# EAGLE design DCDCDC-R2 (EAGLE 9.5.1)
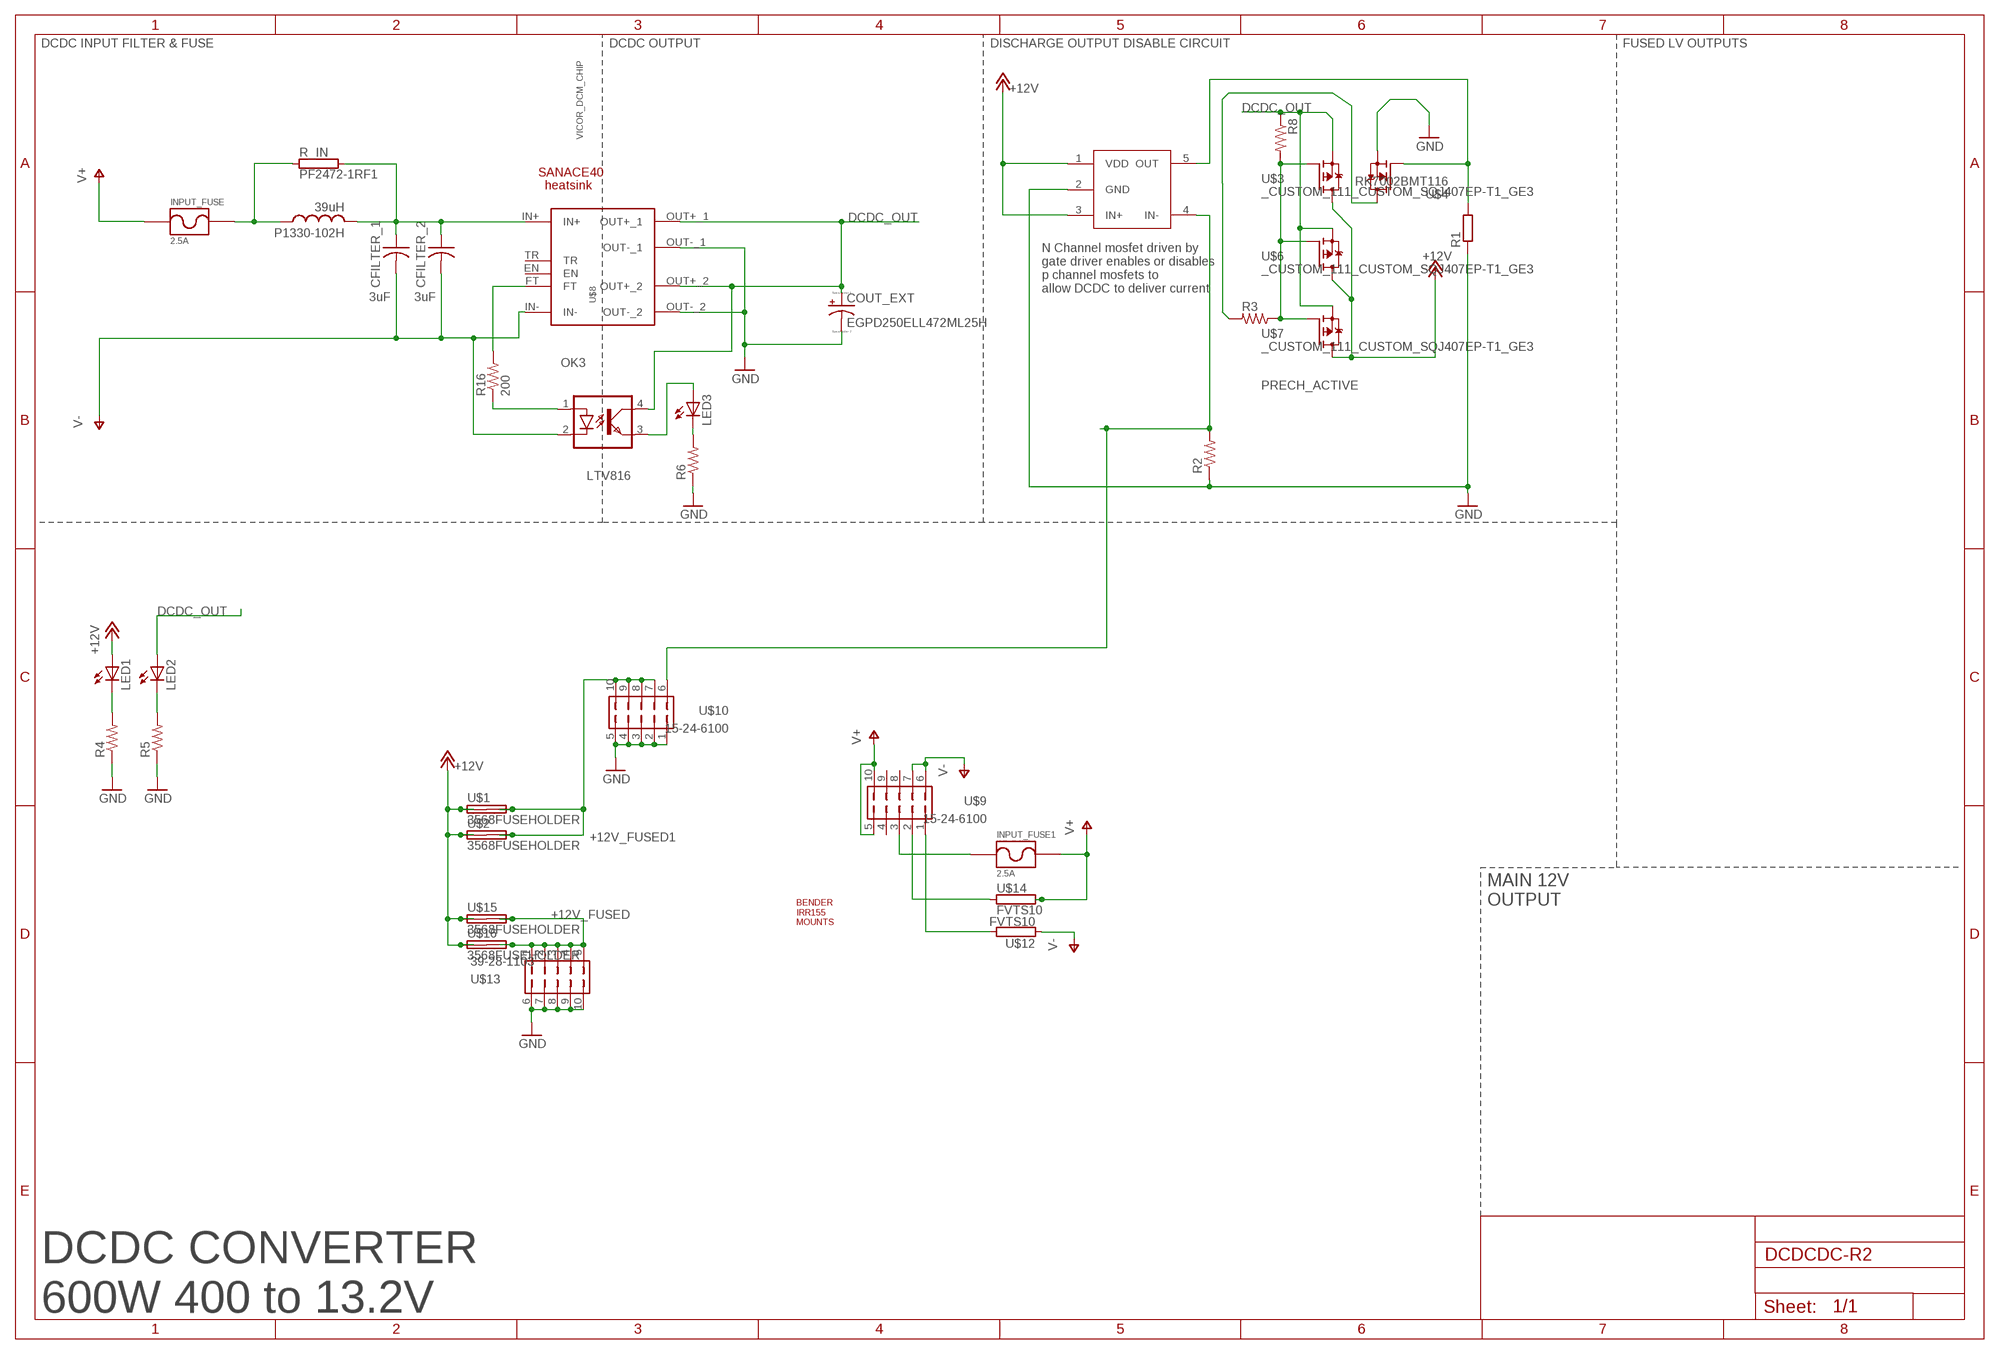
[diagram p0: schematic, sheet 1]

## Parts
CFILTER_1  3uF  B58035U5305M062  [CERALINK_FA3]
CFILTER_2  3uF  B58035U5305M062  [CERALINK_FA3]
COUT_EXT  EGPD250ELL472ML25H  CPOL-USE7.5-16  [E7,5-16]
INPUT_FUSE  2.5A  _CUSTOM_PARTS_LF_885  [_CUSTOM_PARTS_LF_885]
INPUT_FUSE1  2.5A  _CUSTOM_PARTS_LF_885  [_CUSTOM_PARTS_LF_885]
LED1  LED3MM  [LED3MM]
LED2  LED3MM  [LED3MM]
LED3  LED3MM  [LED3MM]
OK3  LTV816  [DIL04]
P1330-102H  39uH  SRP1770TA-390M  [L_1510_NONSTANDARD]
R1  R-EU_R0805  [R0805]
R2  R-US_R0805  [R0805]
R3  R-US_R0805  [R0805]
R4  R-US_R0805  [R0805]
R5  R-US_R0805  [R0805]
R6  R-US_R0805  [R0805]
R8  R-US_R0805  [R0805]
R16  200  R-US_R2010  [R2010]
R_IN  PF2472-1RF1  RMG100-V  [TO-247-2V]
U$1  3568FUSEHOLDER  [3568]
U$2  3568FUSEHOLDER  [3568]
U$3  _CUSTOM_111_CUSTOM_SQJ407EP-T1_GE3  [_CUSTOM_111_CUSTOM_TRANS_SIRA90DP-T1-GE3]
U$4  RK7002BMT116  [SOT23]
U$5  UCC27511AQDBVRQ1  [SOT23-5L]
U$6  _CUSTOM_111_CUSTOM_SQJ407EP-T1_GE3  [_CUSTOM_111_CUSTOM_TRANS_SIRA90DP-T1-GE3]
U$7  _CUSTOM_111_CUSTOM_SQJ407EP-T1_GE3  [_CUSTOM_111_CUSTOM_TRANS_SIRA90DP-T1-GE3]
U$8  VICOR_DCM_CHIP  [VICOR_CHIP_HEATSINK]
U$9  15-24-6100  [15-24-6100]
U$10  15-24-6100  [15-24-6100]
U$11  BENDER_IRR155  [BENDER_IRR155]
U$12  FVTS10  [FVTS10]
U$13  39-28-1103  [39-28-1103]
U$14  FVTS10  [FVTS10]
U$15  3568FUSEHOLDER  [3568]
U$16  3568FUSEHOLDER  [3568]
U$17  VICOR_HEATSINK_19MMLONG  [VICOR_HEATSINK_19MM_LONG]
U$18  SANACE40  [SANACE40]

## Nets
+12V [LV]: LED1.A U$1.L1(1A) U$1.L2(1B) U$2.L1(1A) U$2.L2(1B) U$3.5(D) U$5.1(VDD) U$5.3(IN+) U$6.5(D) U$7.5(D) U$15.L1(1A) U$15.L2(1B) U$16.L1(1A) U$16.L2(1B)
+12V_FUSED: U$13.1 U$13.2 U$13.3 U$13.4 U$13.5 U$15.R1(2A) U$15.R2(2B) U$16.R1(2A) U$16.R2(2B)
+12V_FUSED1: U$1.R1(2A) U$1.R2(2B) U$2.R1(2A) U$2.R2(2B) U$10.7 U$10.8 U$10.9 U$10.10
DCDC_OUT [LV]: COUT_EXT.+ LED2.A OK3.4(COL) R8.1 U$3.1(S) U$3.2(S) U$3.3(S) U$6.1(S) U$6.2(S) U$6.3(S) U$7.1(S) U$7.2(S) U$7.3(S) U$8.OUT+_1 U$8.OUT+_2
GND [LV]: COUT_EXT.- R1.1 R2.1 R4.1 R5.1 R6.1 U$4.2(S) U$5.2(GND) U$8.OUT-_1 U$8.OUT-_2 U$10.1 U$10.2 U$10.3 U$10.4 U$10.5 U$13.6 U$13.7 U$13.8 U$13.9 U$13.10
N$1 [LV]: R3.1 R8.2 U$3.4(G) U$6.4(G) U$7.4(G)
N$2 [LV]: R1.2 U$4.1(G) U$5.5(OUT)
N$3 [LV]: CFILTER_1.P$1 CFILTER_2.P$1 P1330-102H.P$2 R_IN.2 U$8.IN+
N$4 [LV]: R3.2 U$4.3(D)
N$5: LED1.K(C) R4.2
N$6: LED2.K(C) R5.2
N$7: R16.2 U$8.FT
N$8: OK3.1(A) R16.1
N$9: LED3.K(C) R6.2
N$10: LED3.A OK3.3(EMIT)
N$11: INPUT_FUSE1.P$1 U$9.3
N$12: U$9.2 U$14.P$1
N$13: U$9.1 U$12.P$2
PRECH_ACTIVE [LV]: R2.2 U$5.4(IN-) U$10.6
V+ [LV]: INPUT_FUSE1.P$2 INPUT_FUSE.P$1 U$9.5 U$9.10 U$14.P$2
V+_FUSED [LV]: INPUT_FUSE.P$2 P1330-102H.P$1 R_IN.1
V- [LV]: CFILTER_1.P$2 CFILTER_2.P$2 OK3.2(C) U$8.IN- U$9.6 U$9.7 U$12.P$1
Unconnected: U$8.EN U$8.TR U$9.4 U$9.8 U$9.9

## Notes on the sheet
- DCDC INPUT FILTER & FUSE | DCDC OUTPUT | DISCHARGE OUTPUT DISABLE CIRCUIT | FUSED LV OUTPUTS
- N Channel mosfet driven by 
  gate driver enables or disables 
  p channel mosfets to 
  allow DCDC to deliver current
- MAIN 12V
  OUTPUT
- DCDC CONVERTER 
  600W 400 to 13.2V

## Library data of the parts
CFILTER_1 CFILTER_2 = ACC-MB-R0:B58035U5305M062
COUT_EXT = ACC-MB-R0:CPOL-US: POLARIZED CAPACITOR, American symbol
INPUT_FUSE INPUT_FUSE1 = ACC-MB-R0:_CUSTOM_PARTS_LF_885
LED1-LED3 = ACC-MB-R0:LED: LED OSRAM: - CHIPLED LG R971, LG N971, LY N971, LG Q971, LY Q971, LO R971, LY R971 LH N974, LH R974 LS Q976, LO Q976, LY Q976 LO Q996 - Hyper CHIPLED LW Q18S LB Q993, LB Q99A, LB R99A - SideLED LS A670, LO A670, LY A670, LG A670, LP A670 LB A673, LV A673, LT A673, LW A673 LH A674 LY A675 LS A676, LA A676, LO A676, LY A676, LW A676 LS A679, LY A679, LG A679 - Hyper Micro SIDELED® LS Y876, LA Y876, LO Y876, LY Y876 LT Y87S - SmartLED LW L88C, LW L88S LB L89C, LB L89S, LG L890 LS L89K, LO L89K, LY L89K LS L896, LA L896, LO L896, LY L896 - TOPLED LS T670, LO T670, LY T670, LG T670, LP T670 LSG T670, LSP T670, LSY T670, LOP T670, LYG T670 LG T671, LOG T671, LSG T671 LB T673, LV T673, LT T673, LW T673 LH T674 LS T676, LA T676, LO T676, LY T676, LB T676, LH T676, LSB T676, LW T676 LB T67C, LV T67C, LT T67C, LS T67K, LO T67K, LY T67K, LW E67C LS E67B, LA E67B, LO E67B, LY E67B, LB E67C, LV E67C, LT E67C LW T67C LS T679, LY T679, LG T679 LS T770, LO T770, LY T770, LG T770, LP T770 LB T773, LV T773, LT T773, LW T773 LH T774 LS E675, LA E675, LY E675, LS T675 LS T776, LA T776, LO T776, LY T776, LB T776 LHGB T686 LT T68C, LB T68C - Hyper Mini TOPLED® LB M676 - Mini TOPLED Santana® LG M470 LS M47K, LO M47K, LY M47K Source: http://www.osram.convergy.de LUXEON: - LUMILED® LXK2-PW12-R00, LXK2-PW12-S00, LXK2-PW14-U00, LXK2-PW14-V00 LXK2-PM12-R00, LXK2-PM12-S00, LXK2-PM14-U00 LXK2-PE12-Q00, LXK2-PE12-R00, LXK2-PE12-S00, LXK2-PE14-T00, LXK2-PE14-U00 LXK2-PB12-K00, LXK2-PB12-L00, LXK2-PB12-M00, LXK2-PB14-N00, LXK2-PB14-P00, LXK2-PB14-Q00 LXK2-PR12-L00, LXK2-PR12-M00, LXK2-PR14-Q00, LXK2-PR14-R00 LXK2-PD12-Q00, LXK2-PD12-R00, LXK2-PD12-S00 LXK2-PH12-R00, LXK2-PH12-S00 LXK2-PL12-P00, LXK2-PL12-Q00, LXK2-PL12-R00 Source: www.luxeon.com KINGBRIGHT: KA-3528ASYC Source: www.kingbright.com
OK3 = optocoupler:LTV816: OPTO COUPLER Source: LITEON, LTV816.pdf; OC_FARNELL: unknown; OC_NEWARK: unknown
P1330-102H = ACC-MB-R0:SRP1770TA-390M
R1 = ACC-MB-R0:R-EU_: RESISTOR, European symbol; SPICEPREFIX: R
R2-R6 R8 = ACC-MB-R0:R-US_: RESISTOR, American symbol; SPICEPREFIX: R
R16 = Main:R-US_: RESISTOR, American symbol; SPICEPREFIX: R
R_IN = ACC-MB-R0:RMG100: TO-247 Power Resistor - RMG 100 Series Source: www.token.com.tw .. power-resistor-rmg100pdf; OC_FARNELL: unknown; OC_NEWARK: unknown
U$1 U$2 U$15 U$16 = ACC-MB-R0:3568FUSEHOLDER: 3568 20AMP 500VAC
U$3 U$6 U$7 = ACC-MB-R0:_CUSTOM_111_CUSTOM_SQJ407EP-T1_GE3
U$4 = ACC-MB-R0:RK7002BMT116
U$5 = ACC-MB-R0:UCC27511AQDBVRQ1
U$8 = ACC-MB-R0:VICOR_DCM_CHIP
U$9 U$10 = ACC-MB-R0:15-24-6100
U$11 = ACC-MB-R0:BENDER_IRR155
U$12 U$14 = ACC-MB-R0:FVTS10
U$13 = ACC-MB-R0:39-28-1103
U$17 = ACC-MB-R0:VICOR_HEATSINK_19MM
U$18 = ACC-MB-R0:SANACE40

## Net classes
0 default: width 0.1 mm, clearance 0.6 mm
1 LV: clearance 0.1 mm

## Board
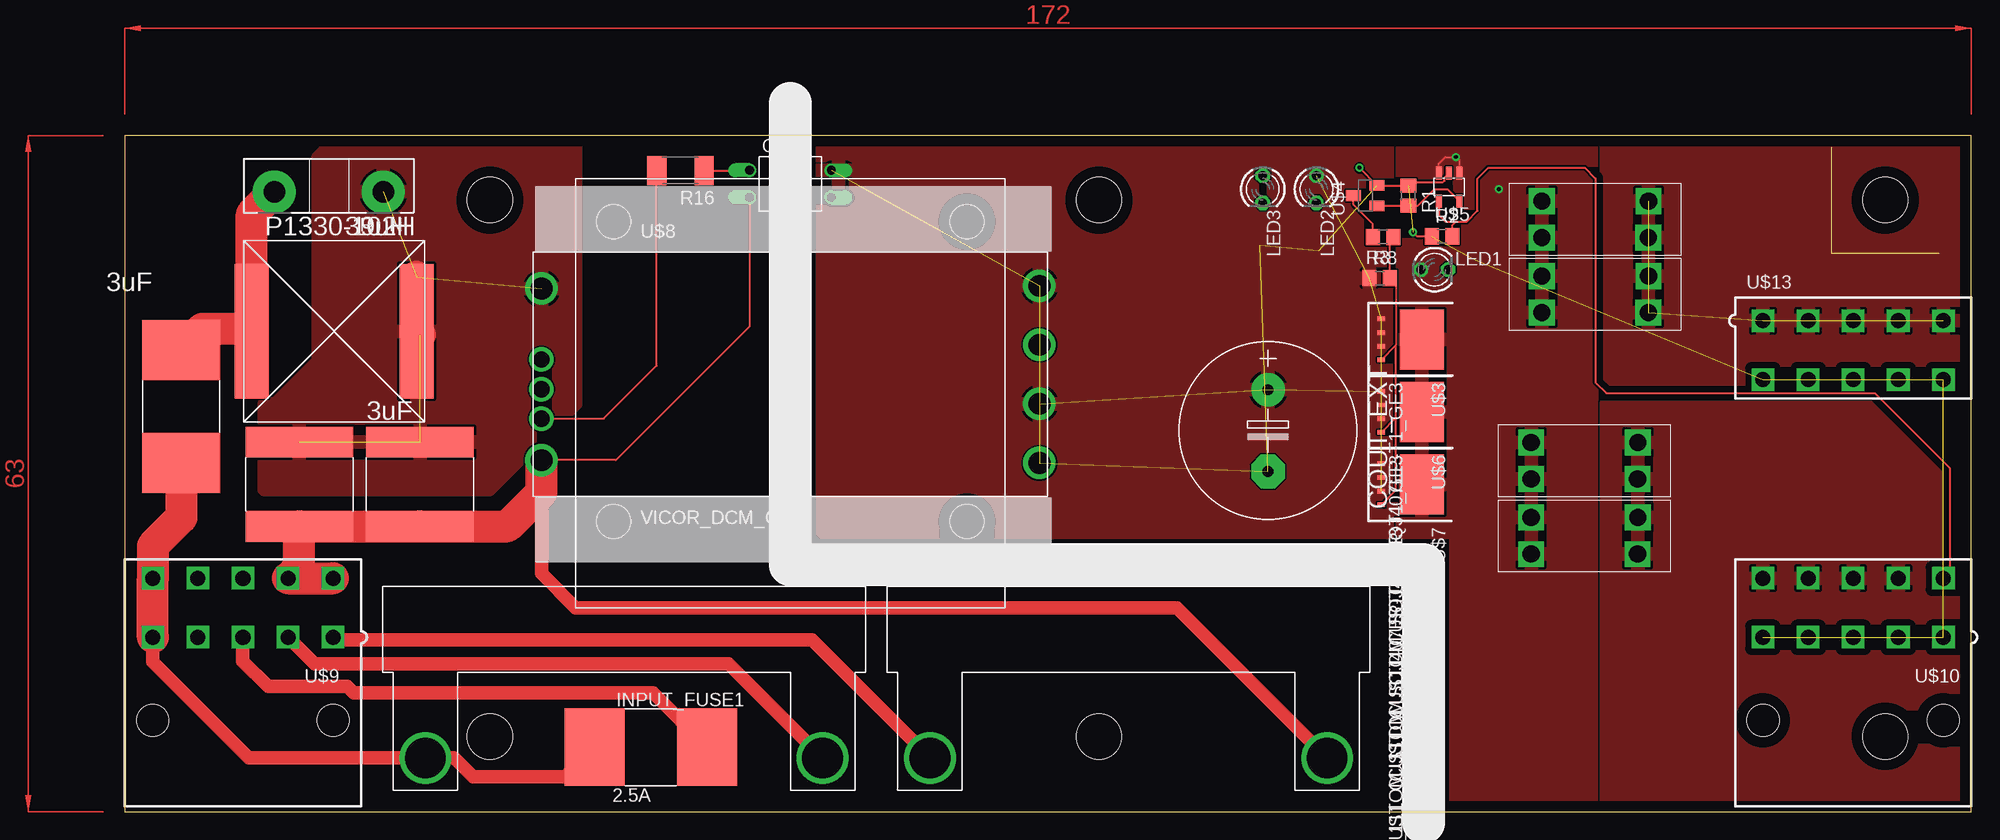
[diagram p1: board, top side]
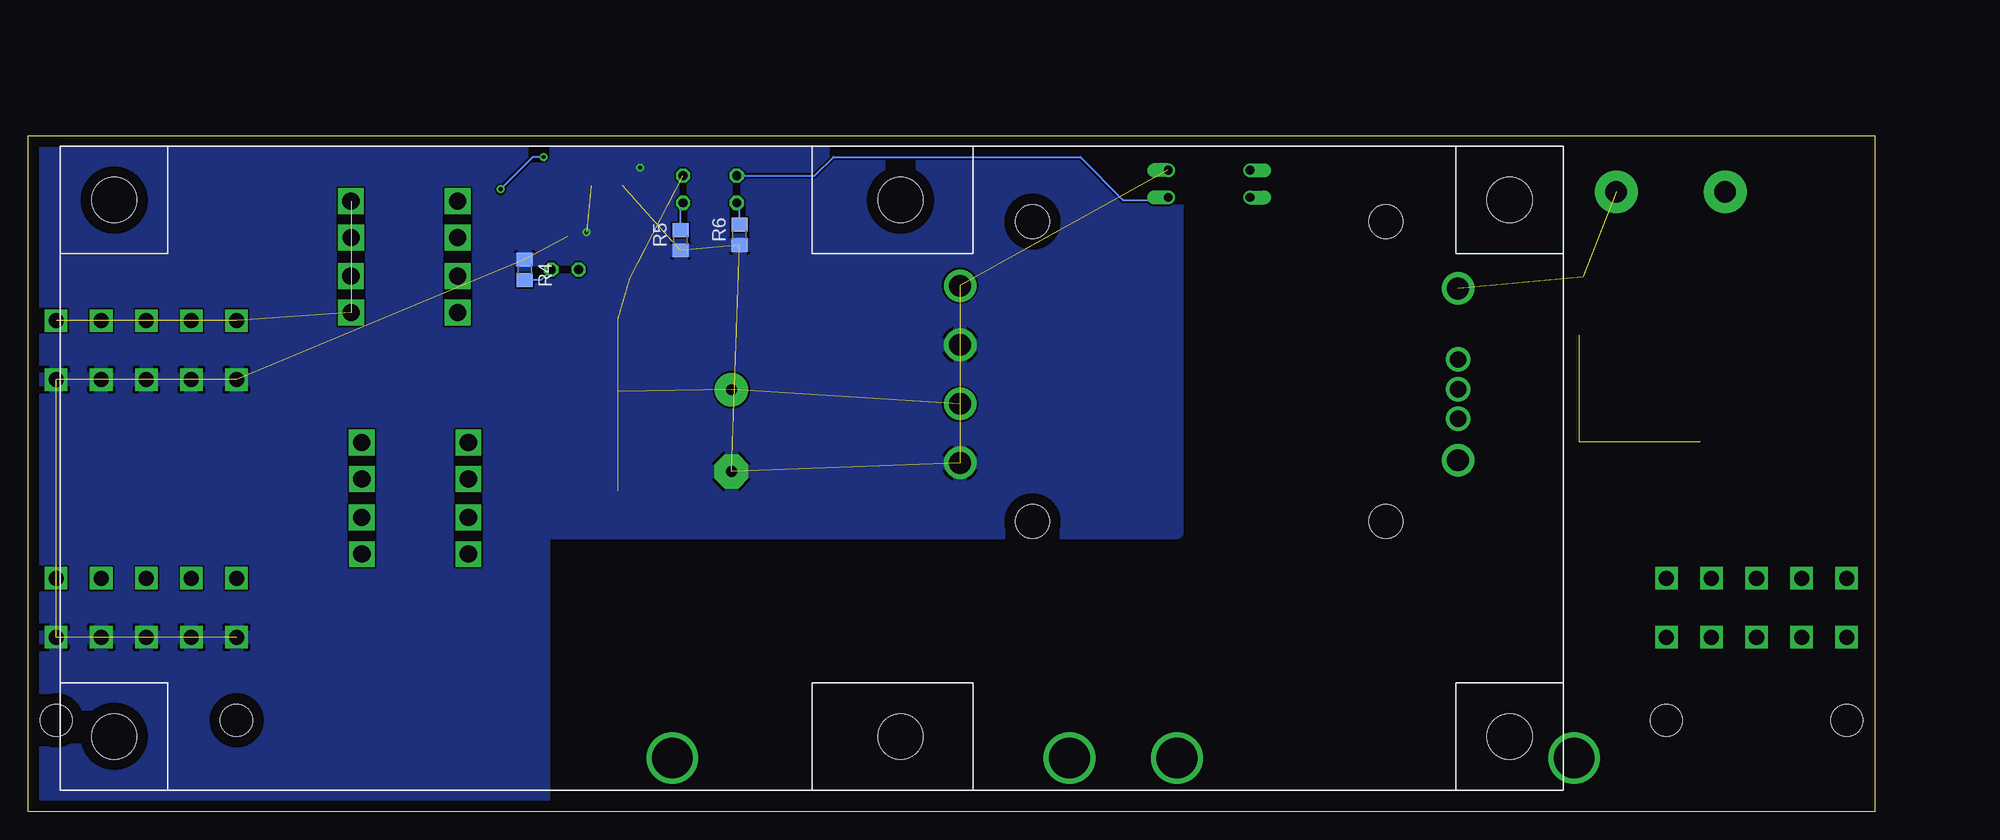
[diagram p2: board, bottom side, seen from below]

Size 172 x 63 mm. Coordinates in mm from the lower left corner, seen from the top.
Outline: 172,63 0,63 0,0 172,0 172,63
Copper layers (1*16): Top 0.035mm / dielectric 1.5mm / Bottom 0.035mm
Design rules "default": minimum track width 6mil, minimum drill 0.35mm, track to track 6mil, track to pad 6mil, pad to pad 6mil, via to via 6mil, smd to smd 6mil, copper to edge 40mil, drill to drill 6mil, minimum pad ring 10mil, minimum via ring 8mil, stop-mask expansion 4mil, vias tented up to drill 0mil, thermal gap 10mil

### Footprints (pad centres in the part's own frame; a part is rotated, then mirrored left to right if it is on the bottom)
CERALINK_FA3 = smd 2.85 x 10: P$1 -3.925,0; P$2 3.925,0
E7,5-16 = drill 1.016 pad 3.15: + -3.81,0 | drill 1.016 pad 3.15 octagon: - 3.81,0
_CUSTOM_PARTS_LF_885 = smd 5.6 x 7.23: P$1 5.25,0; P$2 -5.25,0
LED3MM = drill 0.813 octagon: A -1.27,0; K 1.27,0
DIL04 = drill 0.813 offset: 1 -1.27,-3.81; 2 1.27,-3.81; 3 1.27,3.81; 4 -1.27,3.81
L_1510_NONSTANDARD = smd 3.15 x 12.5: P$1 -7.675,0; P$2 7.675,0
R0805 = smd 1.3 x 1.5: 1 -0.95,0; 2 0.95,0
R2010 = smd 1.8 x 2.7: 1 -2.2,0; 2 2.2,0
TO-247-2V = drill 2 pad 4: 1 -5.08,0; 2 5.08,0
3568 = drill 1.6 square: L1 0,3.4; L2 0,0; R1 9.94,3.4; R2 9.92,0
_CUSTOM_111_CUSTOM_TRANS_SIRA90DP-T1-GE3 = smd 0.41 x 0.72: 1 -1.905,-2.715; 2 -0.635,-2.715; 3 0.635,-2.715; 4 1.905,-2.715 | smd 5.588 x 4.064: 5 0,1.08
SOT23 = smd 1 x 1.4: 1 -0.95,-1.1; 2 0.95,-1.1; 3 0,1.1
SOT23-5L = smd 0.55 x 1.2: 1 -0.95,-1.3; 2 0,-1.3; 3 0.95,-1.3; 4 0.95,1.3; 5 -0.95,1.3
VICOR_CHIP_HEATSINK = drill 1.52 pad 1.77: EN -23.19,-1.38; FT -23.19,-4.13; TR -23.19,1.38 | drill 2.03 pad 2.28: IN+ -23.19,8; IN- -23.19,-8 | drill 2.03 pad 2.41: OUT+_1 23.19,8.25; OUT+_2 23.19,-2.75; OUT-_1 23.19,2.75; OUT-_2 23.19,-8.25
15-24-6100 = drill 1.4 square: 1 8.4,-2.75; 2 4.2,-2.75; 3 0,-2.75; 4 -4.2,-2.75; 5 -8.4,-2.75; 6 8.4,2.75; 7 4.2,2.75; 8 0,2.75; 9 -4.2,2.75; 10 -8.4,2.75 | hole 3: 8.4,-10.5; -8.4,-10.5
BENDER_IRR155 = hole 4.2: 5,5; 5,55; 78.25,55; 78.25,5; 135,55; 135,5
FVTS10 = drill 3.8: P$1 0,0; P$2 37,0
39-28-1103 = drill 1.4 square: 1 -8.4,-2.75; 2 -4.2,-2.75; 3 0,-2.75; 4 4.2,-2.75; 5 8.4,-2.75; 6 -8.4,2.75; 7 -4.2,2.75; 8 0,2.75; 9 4.2,2.75; 10 8.4,2.75
VICOR_HEATSINK_19MM_LONG = hole 3.175: -16.459,13.97; -16.459,-13.97; 16.459,13.97; 16.459,-13.97

### Placement (x,y rotation side)
CFILTER_1  27.5,30.5 270 top
CFILTER_2  16.25,30.5 270 top
COUT_EXT  106.5,35.5 270 top
INPUT_FUSE  5.25,37.75 270 top
INPUT_FUSE1  49,6 0 top
LED1  122,50.5 0 top
LED2  111,58 270 top
LED3  106,58 270 top
OK3  62,58.5 270 top
P1330-102H  19.5,44.75 0 top
R1  119.55,57.4 270 top
R2  122.7,53.6 0 top
R3  117.2,53.55 180 top
R4  125.75,50.5 270 bottom
R5  111.25,53.25 90 bottom
R6  105.75,53.75 90 bottom
R8  116.9,49.7 0 top
R16  51.75,59.75 180 top
R_IN  19,57.75 0 top
U$1  131,24 0 top
U$2  131,31 0 top
U$3  119.75,44 270 top
U$4  115.55,57.4 90 top
U$5  123.35,58.2 180 top
U$6  119.75,37.25 270 top
U$7  119.75,30.5 270 top
U$8  62,40.75 0 top
U$9  11,19 0 top
U$10  161,19 0 top
U$11  169,2 0 bottom
U$12  112,5 180 top
U$13  161,43 180 top
U$14  65,5 180 top
U$15  132,46.5 0 top
U$16  132,53.5 0 top
U$17  62,41 0 top
U$18  42,19 0 top

### Tracks (layer width: path | path; a pad name or v marks a point on that pad's centre or on a via)
+12V  (via drill 0.35)
  Top 0.2: U$5.3 122.4,60.4 123,61 v124,61 124.3,60.7 U$5.1
  Bottom 0.2: v124,61 125,61 v128,58
  pour Top (rank 2): 119,65 119,26 124,26 124,-3 181,-3 181,64 180,65
+12V_FUSED  (8 unrouted)
  pour Top: 138,40 181,40 181,64 180,64 179,65 138,65
+12V_FUSED1
  pour Top: 138,38 138,-3 181,-3 181,38
DCDC_OUT  (14 unrouted)
  pour Top (rank 3): 65,63 65,26 119,26 119,65 67,65
GND  (via drill 0.35)  (17 unrouted)
  Top 0.2: 123.5,59.65 U$5.2 122.93,59.08 122.93,58.8 122.78,58.65 120.15,58.65 119.85,58.35 R1.1 U$4.2 v115,60 | R2.1 120.4,53.6 v120,54
  pour Bottom: 65,67 65,26 124,26 124,-3 181,-3 181,65 67,65
N$1
  Top 0.2: U$7.4 118.4,29.96 118.4,36.71 | 118.4,36.71 118.4,43.46 | U$6.4 118.4,36.71 | U$3.4 118.4,43.46 | 118.4,43.46 118.4,49.15 R8.2 117.85,53.25 R3.1
N$2
  Top 0.2: U$4.1 R1.2 120.45,56.45 122,58 123.2,58 U$5.5
N$3  (4 unrouted)
  Top 3: 27.5,44.42 P1330-102H.P$2 27.17,49.83
  pour Top: 19,62 42,62 42,38 34,30 13,30 13,38 14,38 18,42 18,61
N$4
  Top 0.2: R3.2 116.25,54.75 114.45,56.55 U$4.3
N$5
  Bottom 0.2: LED1.K 124.22,49.55 R4.2
N$6
  Bottom 0.2: R5.2 111.25,56.48 LED2.K
N$7
  Top 0.2: U$8.FT 44.62,36.62 49.55,41.55 R16.2
N$8
  Top 0.2: R16.1 58.17,59.75 OK3.1
N$9
  Bottom 0.2: R6.2 105.75,56.48 LED3.K
N$10
  Bottom 0.2: LED3.A 98.73,59.27 97,61 74,61 70,57 66.04,57 OK3.3
N$11
  Top 1.27: INPUT_FUSE1.P$1 49.2,11.05 21.31,11.05 20.7,11.65 13.35,11.65 11,14 U$9.3
N$12
  Top 1.27: U$14.P$1 56.23,13.77 17.68,13.77 U$9.2
N$13
  Top 1.27: U$12.P$2 64,16 19.65,16 U$9.1
PRECH_ACTIVE
  Top 0.2: U$5.4 122.4,55.6 123,55 124,55 | 124,55 125,55 126,56 126,59 127,60 136,60 137,59 137,40 138,39 163,39 170,32 170,22.35 U$10.6 | R2.2 123.65,54.65 124,55
V+
  Top 1.27: U$9.5 2.6,13.96 11.56,5 U$14.P$2 30.7,5 32.45,3.25 41,3.25 INPUT_FUSE1.P$2
  Top 3: 5.25,29.75 INPUT_FUSE.P$1 5.25,27.4 2.6,24.75 U$9.10 U$9.5
V+_FUSED
  Top 3: INPUT_FUSE.P$2 7.25,45 11.57,45 P1330-102H.P$1 11.82,55.66 R_IN.1
V-
  Top 0.2: OK3.2 58.19,45.19 45.75,32.75 U$8.IN-
  Top 1.27: U$8.IN- 38.81,22.19 42,19 98,19 U$12.P$1
  Top 3: U$8.IN- 38.81,29.75 35.63,26.57 CFILTER_1.P$2 CFILTER_2.P$2 16.25,22.8 U$9.7 U$9.6
(copper drawn outside any net)
  shapes: Top area x2